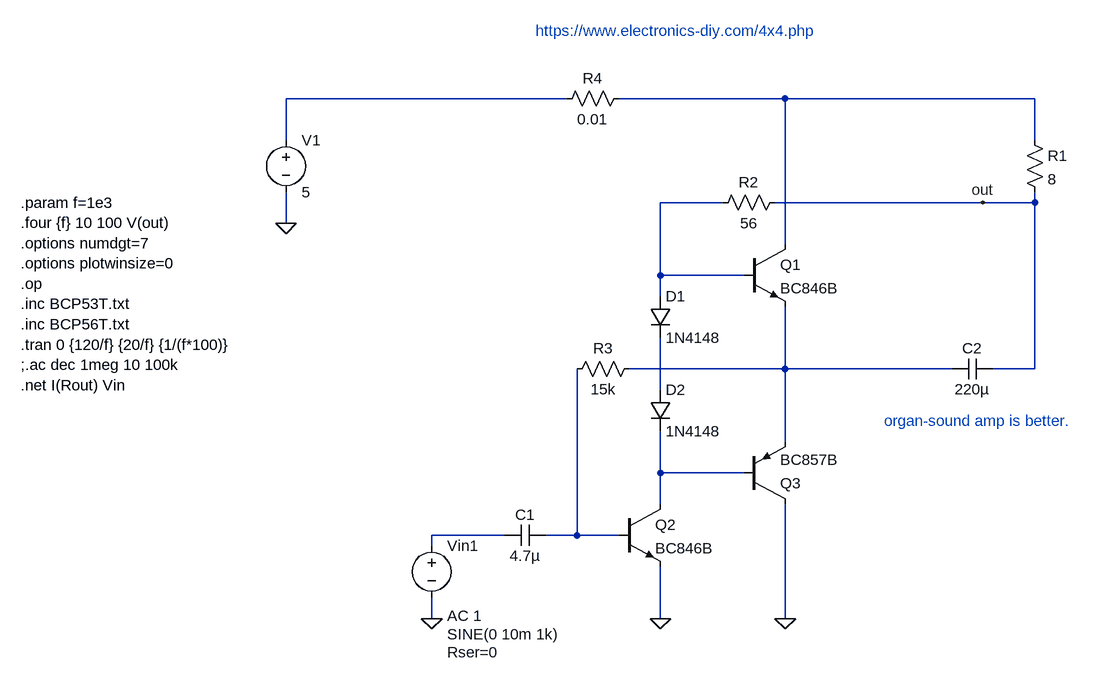
[diagram p0: schematic 4x4.asc]
4x4.asc, the LTspice schematic file:
Version 4
SHEET 1 880 756
WIRE 16 -160 -416 -160
WIRE 352 -160 96 -160
WIRE 736 -160 352 -160
WIRE -416 -96 -416 -160
WIRE 736 -96 736 -160
WIRE 256 0 160 0
WIRE 656 0 336 0
WIRE 736 0 736 -16
WIRE 736 0 656 0
WIRE -416 32 -416 -16
WIRE 352 64 352 -160
WIRE 160 112 160 0
WIRE 288 112 160 112
WIRE 160 144 160 112
WIRE 352 256 352 160
WIRE 352 256 112 256
WIRE 608 256 352 256
WIRE 736 256 736 0
WIRE 736 256 672 256
WIRE 160 288 160 208
WIRE 352 368 352 256
WIRE 160 416 160 352
WIRE 288 416 160 416
WIRE 160 464 160 416
WIRE -80 512 -192 512
WIRE 32 512 32 256
WIRE 32 512 -16 512
WIRE 96 512 32 512
WIRE -192 528 -192 512
WIRE -192 640 -192 608
WIRE 160 640 160 560
WIRE 352 640 352 464
FLAG -192 640 0
FLAG 160 640 0
FLAG -416 32 0
FLAG 352 640 0
FLAG 656 0 out
DATAFLAG 512 256 ""
SYMBOL npn 288 64 R0
SYMATTR InstName Q1
SYMATTR Value BC846B
SYMBOL npn 96 464 R0
SYMATTR InstName Q2
SYMATTR Value BC846B
SYMBOL pnp 288 464 M180
SYMATTR InstName Q3
SYMATTR Value BC857B
SYMBOL res 720 -112 R0
SYMATTR InstName R1
SYMATTR Value 8
SYMBOL res 352 -16 R90
WINDOW 0 0 56 VBottom 2
WINDOW 3 32 56 VTop 2
SYMATTR InstName R2
SYMATTR Value 56
SYMBOL res 128 240 R90
WINDOW 0 0 56 VBottom 2
WINDOW 3 32 56 VTop 2
SYMATTR InstName R3
SYMATTR Value 15k
SYMBOL cap -16 496 R90
WINDOW 0 0 32 VBottom 2
WINDOW 3 32 32 VTop 2
SYMATTR InstName C1
SYMATTR Value 4.7µ
SYMBOL diode 144 144 R0
SYMATTR InstName D1
SYMATTR Value 1N4148
SYMBOL diode 144 288 R0
SYMATTR InstName D2
SYMATTR Value 1N4148
SYMBOL voltage -416 -112 R0
SYMATTR InstName V1
SYMATTR Value 5
SYMBOL voltage -192 512 R0
WINDOW 3 24 152 Left 2
WINDOW 123 24 124 Left 2
WINDOW 39 24 180 Left 2
SYMATTR Value SINE(0 10m 1k)
SYMATTR Value2 AC 1
SYMATTR SpiceLine Rser=0
SYMATTR InstName Vin1
SYMBOL cap 672 240 R90
WINDOW 0 0 32 VBottom 2
WINDOW 3 32 32 VTop 2
SYMATTR InstName C2
SYMATTR Value 220µ
SYMBOL res 112 -176 R90
WINDOW 0 0 56 VBottom 2
WINDOW 3 32 56 VTop 2
SYMATTR InstName R4
SYMATTR Value 0.01
TEXT -824 0 Left 2 !.param f=1e3\n.four {f} 10 100 V(out)\n.options numdgt=7\n.options plotwinsize=0\n.op\n.inc BCP53T.txt\n.inc BCP56T.txt\n.tran 0 {120/f} {20/f} {1/(f*100)}\n;.ac dec 1meg 10 100k\n.net I(Rout) Vin
TEXT -32 -264 Left 2 ;https://www.electronics-diy.com/4x4.php
TEXT 504 336 Left 2 ;organ-sound amp is better.

The netlist it stands for:
* 4x4.asc
Q1 N002 N003 N004 0 BC846B
Q2 N006 N008 0 0 BC846B
Q3 0 N006 N004 0 BC857B
R1 N002 out 8
R2 out N003 56
R3 N004 N008 15k
C1 N008 N007 4.7µ
D1 N003 N005 1N4148
D2 N005 N006 1N4148
V1 N001 0 5
Vin1 N007 0 SINE(0 10m 1k) AC 1 Rser=0
C2 out N004 220µ
R4 N002 N001 0.01
.model D D
.lib standard.dio
.model NPN NPN
.model PNP PNP
.lib standard.bjt
.param f=1e3
.four {f} 10 100 V(out)
.options numdgt=7
.options plotwinsize=0
.op
.inc BCP53T.txt
.inc BCP56T.txt
.tran 0 {120/f} {20/f} {1/(f*100)}
;.ac dec 1meg 10 100k
.net I(Rout) Vin
* https://www.electronics-diy.com/4x4.php
* organ-sound amp is better.
.backanno
.end